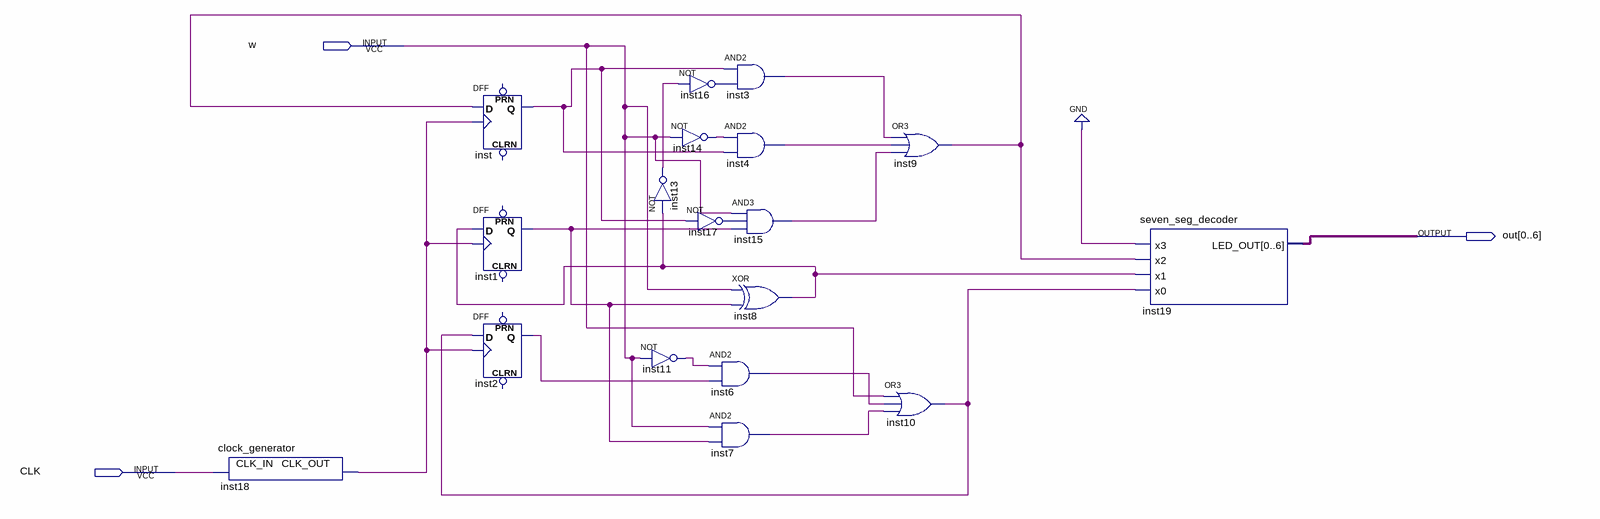
[diagram p0: schematic sheet]
// Quartus schematic lab11step2.bdf as structural Verilog: 18 symbols, 3 pins
module lab11step2 (
  input  w,
  input  CLK,
  output [0:6] out
);

  wire inst1_q, inst2_q, inst3_out, inst4_out, inst6_out, inst7_out, inst8_out, inst9_out, inst10_out,
       inst11_out, inst13_out, inst14_out, inst15_out, inst16_out, inst17_out, inst18_clk_out, inst_q;

  clock_generator inst18 (.CLK_IN(CLK), .CLK_OUT(inst18_clk_out));
  DFF inst (.CLK(inst18_clk_out), .D(inst9_out), .Q(inst_q));  // open: CLRN, PRN
  DFF inst1 (.CLK(inst18_clk_out), .D(inst8_out), .Q(inst1_q));  // open: CLRN, PRN
  DFF inst2 (.CLK(inst18_clk_out), .D(inst10_out), .Q(inst2_q));  // open: CLRN, PRN
  not inst13 (inst13_out, inst8_out);
  not inst11 (inst11_out, w);
  not inst16 (inst16_out, inst13_out);
  not inst14 (inst14_out, w);
  not inst17 (inst17_out, inst_q);
  and inst6 (inst6_out, inst11_out, inst2_q);
  and inst7 (inst7_out, w, inst1_q);
  and inst3 (inst3_out, inst_q, inst16_out);
  and inst4 (inst4_out, inst14_out, inst_q);
  and inst15 (inst15_out, w, inst17_out, inst1_q);
  xor inst8 (inst8_out, w, inst1_q);
  or inst9 (inst9_out, inst3_out, inst4_out, inst15_out);
  or inst10 (inst10_out, w, inst6_out, inst7_out);
  seven_seg_decoder inst19 (.x3(1'b0), .x2(inst9_out), .x1(inst8_out), .x0(inst10_out), .LED_OUT(out));
endmodule
